# EasyEDA Pro project 主板以及2.4GHz接收器.eprj, board PCB7
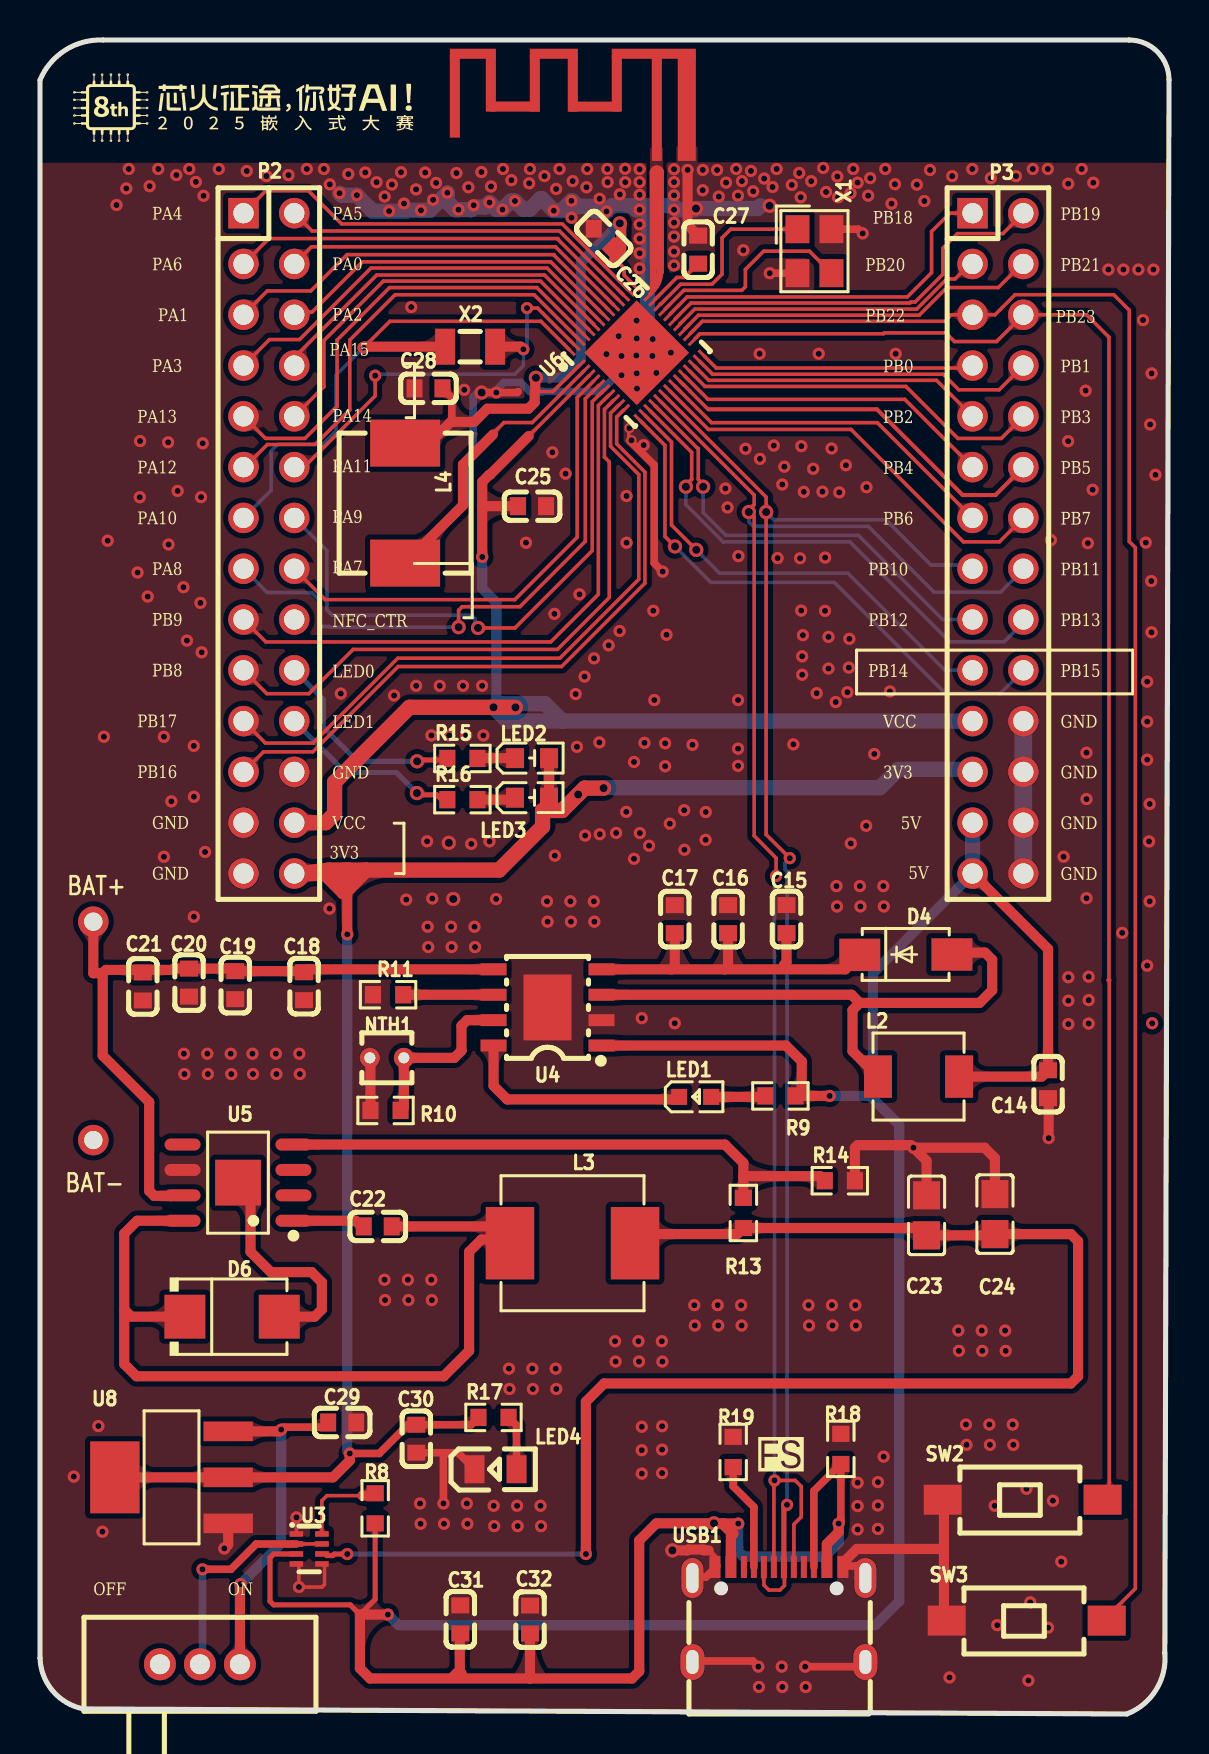
[diagram p12: board, top side]
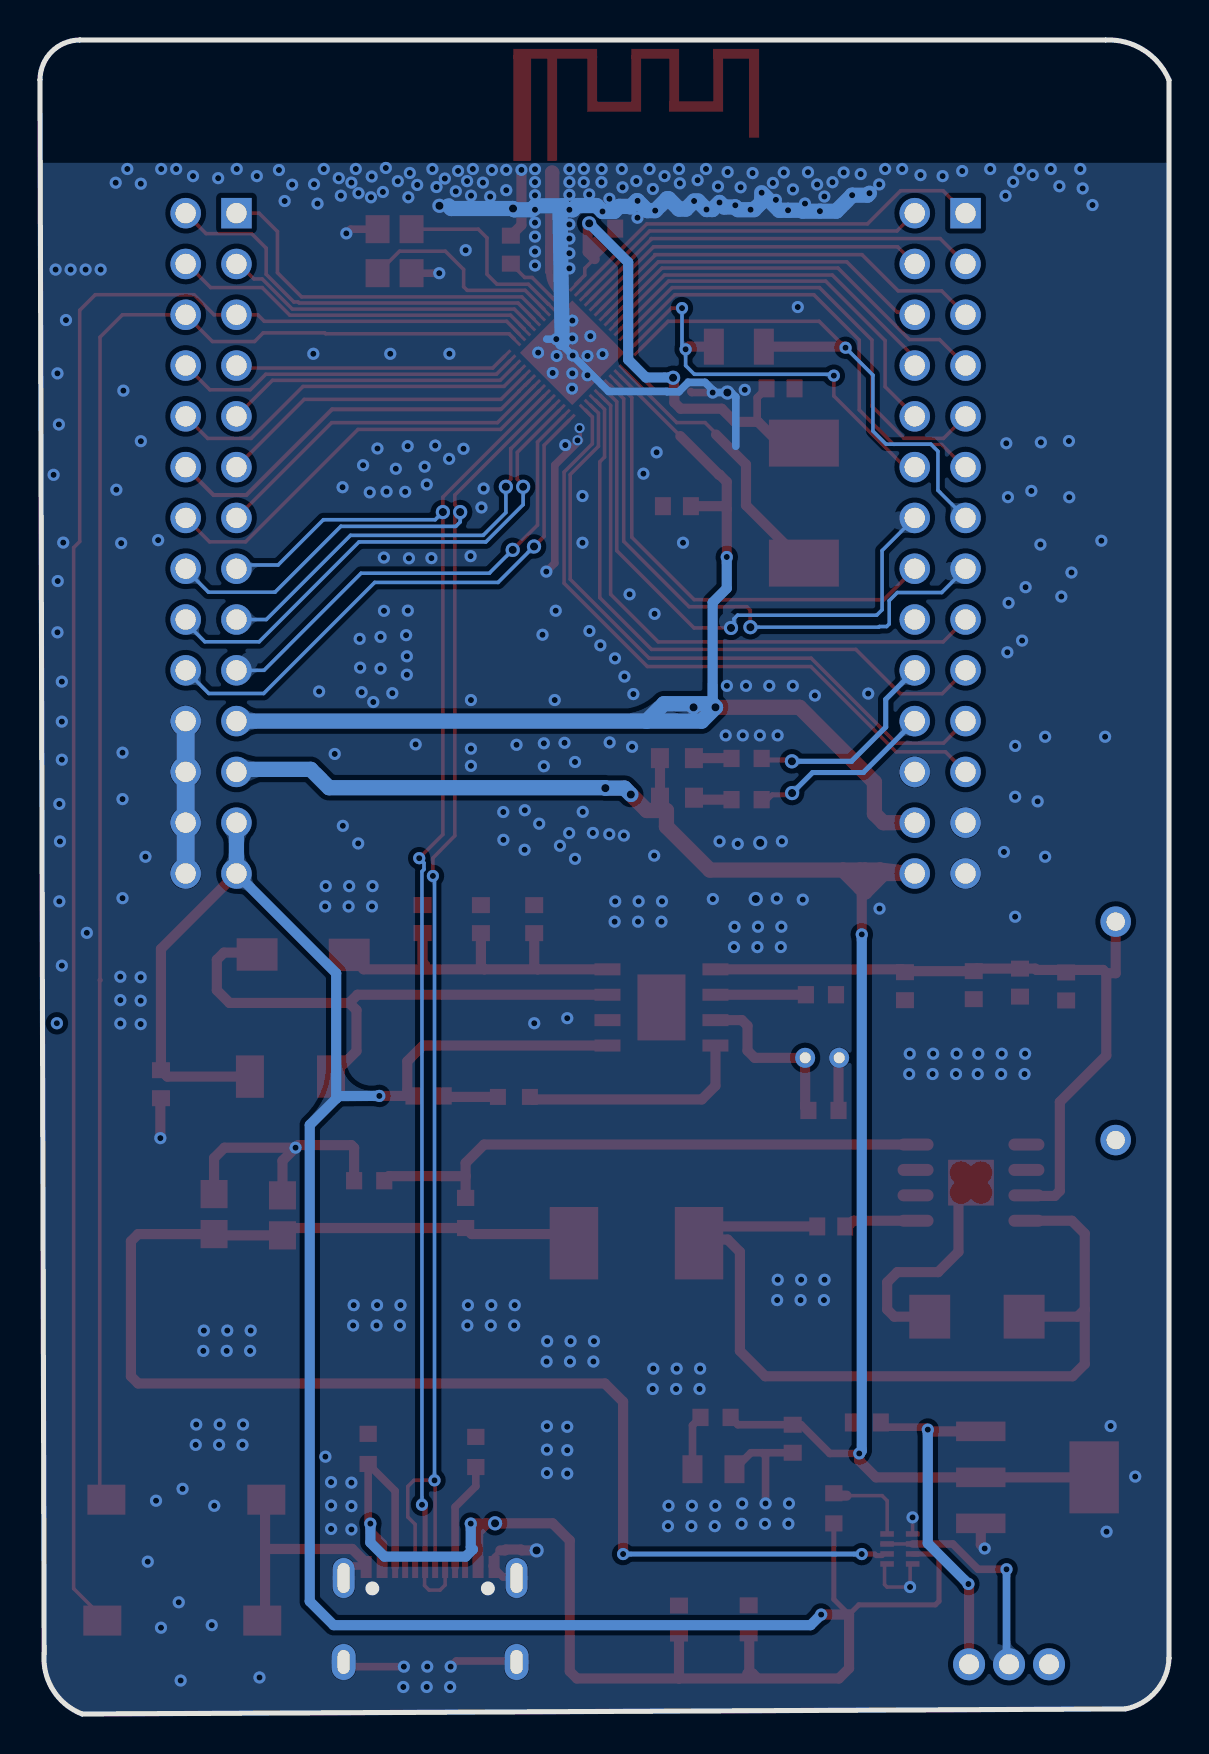
[diagram p13: board, bottom side, seen from below]

Outline 56.47 x 83.71 mm; copper layers: Top Layer, Bottom Layer. Coordinates in mm from the lower left corner of the outline.
Outline path: 0,81.71 arc(1.27,83.21) 3.16,83.71 54.47,83.71 arc(55.88,83.13) 56.47,81.71 56.26,3.05 arc(55.82,1.21) 54.36,0 2.18,0.25 arc(0.65,1.14) 0,2.79 0,81.71
Stack: Top Layer 0.035mm / Dielectric1 1.51mm FR4 er 4.5 / Bottom Layer 0.035mm

## Design rules (mm)
template: 自定义配置
spacing Clearance (default): track to track 0.127, other pairs 0 to 0.152
spacing Clearance_1: track to track 0.152, other pairs 0.152 to 0.152
spacing Clearance_3: track to track 0.254, other pairs 0 to 0.254
track width Width (default): min 0.127, default 0.178, max 1.27
differential pair DiffPairsRouting (default): width min 0.178, default 0.381, max 0.381; gap min 0.152, default 0.254
via RoutingVias (default): diameter min 0.508, default 0.61, max 1.27; hole min 0.305, default 0.305, max 0.711
region e2530 uses Clearance_1, DiffPairsRouting, HoleToHoleClearance, PlaneConnect, RF, RoutingVias, Width

## Placement (name value [footprint] x y rotation side)
C14  100nF  [C0603#2]  50.42 31.49 90 top
C15  10uF  [C0603#2]  37.34 39.75 270 top
C16  10uF  [C0603#2]  34.42 39.75 270 top
C17  10uF  [C0603#2]  31.75 39.75 270 top
C18  10uF  [C0603#2]  13.21 36.39 90 top
C19  10uF  [C0603#2]  9.77 36.45 90 top
C20  10uF  [C0603#2]  7.45 36.57 90 top
C21  10uF  [C0603#2]  5.14 36.38 90 top
C22  100nF  [C0603#2]  16.89 24.38 0 top
C23  22uF  [C0805]  44.34 24.94 90 top
C24  22uF  [C0805]  47.76 25 90 top
C25  2.2uF  [C0603#2]  24.61 60.4 180 top
C26  100nF  [C0603]  28.19 73.78 135 top
C27  470nF  [C0603#2]  32.92 73.23 270 top
C28  4.7uF  [C0603#2]  19.43 66.29 0 top
C29  10uF  [C0603#2]  15.11 14.58 180 top
C30  22uF  [C0603#2]  18.82 13.76 90 top
C31  22uF  [C0603#2]  21.02 4.73 270 top
C32  22uF  [C0603#2]  24.51 4.72 270 top
D4  SS54  [SMA_L4.3-W2.6-LS5.0-FD]  43.31 37.97 180 top
D6  SS54SMB  [SMB_L4.6-W3.6-LS5.3-RD]  9.61 19.87 0 top
E1  F  [ANT-F-1-2.4G-1.6mmFR4]  30.86 77.98 0 top
L2  2.2uH  [IND-SMD_L4.4-W4.2]  43.94 31.88 0 top
L3  15uH  [IND-SMD_L7.0-W6.6_FXL0630]  26.64 23.54 180 top
L4  10uH  [IND-SMD_L7.3-W6.8]  18.26 60.55 90 top
LED1  LTST-C190KSKT  [LED0603-RD]  32.77 30.86 0 top
LED2  YLED0603B  [LED0603-FD]  24.61 45.82 180 top
LED3  YLED0603R  [LED0603-FD]  24.61 47.8 180 top
LED4  NCD0805R1  [LED0805-R-RD]  22.78 12.24 0 top
NOREF  -  [Pad_e1653]  2.67 28.7 0 top
NOREF#2  -  [Pad_e1652]  2.67 39.62 0 top
NTH1  100K  [RES-TH_L2.5-W2.5-P1.70-D0.3]  17.35 32.81 180 top
P2  HEADER 14x2  [IDC28-2.54MM]  10.18 75.05 0 top
P3  HEADER 14x2  [IDC28-2.54MM]  46.64 75.05 0 top
R8  10kΩ  [R0603]  16.76 10.28 270 top
R9  1kΩ  [R0603]  37.03 30.91 180 top
R10  82kΩ  [R0603]  17.28 30.18 180 top
R11  1kΩ  [R0603]  17.41 35.97 180 top
R13  10kΩ  [R0603]  35.18 25.05 90 top
R14  3.16kΩ  [R0603]  40.01 26.67 0 top
R15  1kΩ  [R0603]  21.13 47.78 0 top
R16  1kΩ  [R0603]  21.13 45.72 0 top
R17  1kΩ  [R0603]  22.68 14.83 0 top
R18  5.1kΩ  [R0603]  40.06 13.26 270 top
R19  5.1kΩ  [R0603]  34.67 13.1 270 top
SW1  SSSS916900  [SW-TH_SSSS916900]  8 2.49 90 top
SW2  TS-1101-C-W  [SW-SMD_L6.0-W3.3-LS8.0]  49.15 10.72 0 top
SW3  TS-1101-C-W  [SW-SMD_L6.0-W3.3-LS8.0]  49.35 4.67 0 top
U3  LM66200DRLR  [SOT-583-8_L2.1-W1.2-P0.50-LS1.6-BL]  13.46 8.25 270 top
U4  SCS5090EA  [ESOP-8_L4.9-W3.9-P1.27-LS6.0-BL-EP3.3]  25.39 35.33 90 top
U5  TPS5450DDAR  [SOP-8_L4.9-W3.9-P1.27-LS6.0-BL-EP]  9.9 26.57 90 top
U6  CH585M  [QFN-48_L5.0-W5.0-P0.35-TL-EP3.7-1]  29.85 68.07 45 top
U8  AMS1117-3.3  [SOT-223-4_L6.5-W3.5-P2.30-LS7.0-BR]  6.58 11.83 0 top
USB1  TYPE-C 16PIN 2MD(073)  [USB-C-SMD_TYPE-C-6PIN-2MD-073]  36.96 4.98 0 top
X1  32MHz  [CRYSTAL-SMD_4P-L3.2-W2.5-BL]  38.73 73.15 270 top
X2  32.768kHz  [FC-135R_L3.2-W1.5]  21.51 68.37 0 top

## Footprints (pads in the part's own frame, mm; a bottom-side part is the same pattern mirrored in y, then rotated)
ANT-F-1-2.4G-1.6mmFR4
  rect 0.8x0.6 smd: 0(1.483,0)
  rect 0.4x0.6 smd: 1(0,0)
C0603
  rect 0.8x0.9 smd: 1(-0.7,0)
  rect 0.8x0.9 smd rot 45: 2(0.7,0)
C0603#2
  rect 0.8x0.9 smd: 1(-0.7,0) 2(0.7,0)
C0805
  rect 1.41x1.35 smd: 1(-1,0) 2(1,0)
CRYSTAL-SMD_4P-L3.2-W2.5-BL
  rect 1.4x1.2 smd: 1(-1.1,-0.85) 2(1.1,-0.85) 3(1.1,0.85) 4(-1.1,0.85)
ESOP-8_L4.9-W3.9-P1.27-LS6.0-BL-EP3.3
  rect 0.6x1.3 smd: 1(-1.905,-2.7) 2(-0.635,-2.7) 3(0.635,-2.7) 4(1.905,-2.7) 5(1.905,2.7) 6(0.635,2.7) 7(-0.635,2.7) 8(-1.905,2.7)
  rect 3.3x2.4 smd: 9(0,0)
FC-135R_L3.2-W1.5
  rect 1x1.8 smd: 1(-1.25,0) 2(1.25,0)
IDC28-2.54MM
  rect 1.524x1.524 hole 1.016: 1(0,0)
  round 1.524 hole 1.016: 2(2.54,0) 3(0,-2.54) 4(2.54,-2.54) 5(0,-5.08) 6(2.54,-5.08) 7(0,-7.62) 8(2.54,-7.62) 9(0,-10.16) 10(2.54,-10.16) 11(0,-12.7) 12(2.54,-12.7) 13(0,-15.24) 14(2.54,-15.24) 15(0,-17.78) 16(2.54,-17.78) 17(0,-20.32) 18(2.54,-20.32) 19(0,-22.86) 20(2.54,-22.86) 21(0,-25.4) 22(2.54,-25.4) 23(0,-27.94) 24(2.54,-27.94) 25(0,-30.48) 26(2.54,-30.48) 27(0,-33.02) 28(2.54,-33.02)
IND-SMD_L4.4-W4.2
  rect 1.4x2.12 smd: 1(2.028,0) 2(-2.028,0)
IND-SMD_L7.0-W6.6_FXL0630
  rect 2.424x3.62 smd: 1(3.128,0) 2(-3.128,0)
IND-SMD_L7.3-W6.8
  rect 2.35x3.5 smd: 1(-3,0) 2(3,0)
LED0603-FD
  rect 0.9x1 smd: 1(-0.85,0) 2(0.85,0)
LED0603-RD
  rect 0.8x0.8 smd: 1(-0.799,0) 2(0.799,0)
LED0805-R-RD
  rect 1x1.399 smd: 1(1.05,0) 2(-1.05,0)
Pad_e1652
  round 1.524 hole 0.914: 1(0,0)
Pad_e1653
  round 1.524 hole 0.914: 1(0,0)
QFN-48_L5.0-W5.0-P0.35-TL-EP3.7-1
  rect 0.8x0.15 smd: 1(-2.5,1.575) 2(-2.5,1.225) 3(-2.5,0.875) 4(-2.5,0.525) 5(-2.5,0.175) 6(-2.5,-0.175) 7(-2.5,-0.525) 8(-2.5,-0.875) 9(-2.5,-1.225) 10(-2.5,-1.575) 25(2.5,-1.575) 26(2.5,-1.225) 27(2.5,-0.875) 28(2.5,-0.525) 29(2.5,-0.175) 30(2.5,0.175) 31(2.5,0.525) 32(2.5,0.875) 33(2.5,1.225) 34(2.5,1.575)
  rect 0.15x0.8 smd: 11(-2.275,-2.5) 12(-1.925,-2.5) 13(-1.575,-2.5) 14(-1.225,-2.5) 15(-0.875,-2.5) 16(-0.525,-2.5) 17(-0.175,-2.5) 18(0.175,-2.5) 19(0.525,-2.5) 20(0.875,-2.5) 21(1.225,-2.5) 22(1.575,-2.5) 23(1.925,-2.5) 24(2.275,-2.5) 35(2.275,2.5) 36(1.925,2.5) 37(1.575,2.5) 38(1.225,2.5) 39(0.875,2.5) 40(0.525,2.5) 41(0.175,2.5) 42(-0.175,2.5) 43(-0.525,2.5) 44(-0.875,2.5) 45(-1.225,2.5) 46(-1.575,2.5) 47(-1.925,2.5) 48(-2.275,2.5)
  rect 3.7x3.7 smd: 49(0.001,0)
R0603
  rect 0.806x0.864 smd: 1(-0.753,0) 2(0.753,0)
RES-TH_L2.5-W2.5-P1.70-D0.3
  round 1 hole 0.55: 1(-0.85,0) 2(0.85,0)
SMA_L4.3-W2.6-LS5.0-FD
  rect 2.046x1.62 smd: 1(-2.304,-0.009) 2(2.304,0.009)
SMB_L4.6-W3.6-LS5.3-RD
  rect 2.047x2.192 smd: 1(-2.361,0) 2(2.361,0)
SOP-8_L4.9-W3.9-P1.27-LS6.0-BL-EP
  oval 0.6x1.8 smd: 1(-1.905,-2.772) 2(-0.635,-2.772) 3(0.635,-2.772) 4(1.905,-2.772) 5(1.905,2.772) 6(0.635,2.772) 7(-0.635,2.772) 8(-1.905,2.772)
  rect 2.29x2.29 smd: 9(0,0)
SOT-223-4_L6.5-W3.5-P2.30-LS7.0-BR
  rect 2.47x0.98 smd: 1(2.835,-2.3) 2(2.835,0) 3(2.835,2.3)
  rect 2.47x3.6 smd: 4(-2.835,0)
SOT-583-8_L2.1-W1.2-P0.50-LS1.6-BL
  rect 0.28x0.68 smd: 1(-0.75,-0.64) 2(-0.25,-0.64) 3(0.25,-0.64) 4(0.75,-0.64) 5(0.75,0.64) 6(0.25,0.64) 7(-0.25,0.64) 8(-0.75,0.64)
SW-SMD_L6.0-W3.3-LS8.0
  rect 1.9x1.5 smd: 1(-4,0) 2(4,0)
SW-TH_SSSS916900
  round 1.6 hole 1: 1(0,2) 2(0,0) 3(0,-2)
USB-C-SMD_TYPE-C-6PIN-2MD-073
  rect 0.55x1.1 smd: 1(-3.2,2.375) 2(-2.4,2.375) 11(2.4,2.375) 12(3.2,2.375)
  rect 0.3x1.1 smd: 3(-1.75,2.375) 4(-1.25,2.375) 5(-0.75,2.375) 6(-0.25,2.375) 7(0.25,2.375) 8(0.75,2.375) 9(1.25,2.375) 10(1.75,2.375)
  oval 1.1x2 hole 0.6x1.5: 13(-4.325,1.825) 14(4.325,1.825)
  oval 1.2x1.8 hole 0.6x1.2: 13(-4.325,-2.375) 14(4.325,-2.375)

## Nets
As in the schematic, except:
BAT+: C18.2 C19.2 C20.2 C21.2 NOREF#2.1 U4.5 U5.7

Pads without a net: E1 0; NOREF 1; P2 17 18 19 21 23; SW1 1; U5 2 3 5; U6 7 8 9 10; USB1 3 9

## Via types
v1: diameter 0.61, hole 0.305, Top Layer to Bottom Layer, 433 vias
v2: diameter 0.711, hole 0.406, Top Layer to Bottom Layer, 23 vias
v3: diameter 0.508, hole 0.305, Top Layer to Bottom Layer, 2 vias

## Routing (per net, layer and track width the routed paths; a pad name or vN(x,y) marks a point on that pad's centre or on a via; arc(x,y) is an arc through that point)
+3V3: length 94.1
  Top Layer w0.381: v1(15.49,13.03) 16.97,13.03 18.4,14.46 C30.2 21.56,14.46 R17.1
  Top Layer w0.508: LED2.1 25.46,47.8 LED3.1 ; U8.4 U8.2 14.66,11.83 15.49,12.67 v1(15.49,13.03) ; 15.21,41.11 15.37,40.95 v1(15.37,38.99)
  Top Layer w0.762: 16.3,42.2 22.96,42.2 25.14,44.38 25.14,45.18 26.12,45.18 v2(26.92,45.98) 27.24,46.3 v2(28.19,46.3) ; 16.3,42.2 15.46,42.2 ; 16.3,42.2 15.44,41.34 ; 13.01,42.03 14.29,42.03 ; 13.01,42.03 P2.28 ; 13.01,42.03 14.46,42.2 ; 14.29,42.03 14.46,42.2 ; 14.29,42.03 15.21,41.11 ; 15.44,41.34 15.46,42.2 ; 15.44,41.34 15.21,41.11 ; 15.46,42.2 15.21,42.2 ; 14.46,42.2 15.21,42.2 ; 15.21,42.2 15.21,41.11
  Bottom Layer w0.508: v1(15.37,38.99) 15.37,13.16 v1(15.49,13.03)
  Bottom Layer w0.762: P3.23 46.52,47.24 42.93,47.24 42.01,46.32 28.21,46.32 v2(28.19,46.3) 27.24,46.3 v2(26.92,45.98)
+5V: length 169.2
  Top Layer w0.254: U3.3 11.68,8 11.5,7.82 11.5,5.64 11.68,5.46 15.52,5.46 16,4.97 16.76,5.73 R8.2
  Top Layer w0.381: v1(39.95,9.52) 40.06,9.63 R18.2 38.71,11.15 38.71,7.35
  Top Layer w0.508: U4.1 37.31,33.43 38.1,32.64 38.1,31.22 R9.1 v1(39.5,30.91) ; v1(34.92,9.52) 33.72,9.52 v2(33.71,9.54) 30.83,9.54 29.97,8.68 29.97,2.13 29.61,1.78 24.51,1.78 ; 24.51,1.78 24.51,1.78 24.51,3.81 ; 24.51,1.78 16.51,1.78 16,2.28 16,4.97 v1(17.4,4.97) ; P3.27 50.42,38.26 C14.2 50.1,31.88 L2.1 ; 20.6,1.8 20.83,2.03 21.08,2.03 21,2.12 21,3.68 ; 34.66,9.01 34.56,8.9 USB1.2 ; USB1.11 39.36,8.51 39.95,9.09 v1(39.95,9.52)
  Top Layer w0.559: 34.66,9.01 34.15,9.52
  Bottom Layer w0.508: P3.27 41.66,37.04 41.66,30.77 ; 41.66,30.77 42.98,29.45 42.98,5.64 41.78,4.44 17.93,4.44 v1(17.4,4.97) ; 41.66,30.77 41.52,30.91 v1(39.5,30.91) ; v1(34.92,9.52) 34.92,8.34 34.82,8.23 35.18,7.87 39.24,7.87 39.95,8.57 v1(39.95,9.52)
  Bottom Layer w0.762: P3.27 P3.25
GND: length 120.8
  Top Layer w0.178: 13.08,6.35 14.1,6.35 14.23,6.47 14.23,7.5 ; v1(12.95,6.35) 12.95,6.35 12.95,7.5 ; 29.46,64.3 29.45,64.29 29.45,63.72 ; v1(12.83,9.83) 12.83,9.01 U3.1
  Top Layer w0.254: USB1.1 33.76,7.87 33.45,8.18
  Top Layer w0.381: LED4.2 20.91,13.06 20.35,13.06 ; 23.92,66.13 23.87,66.08 v1(22.82,66.08) v2(22.09,66.08) ; X1.4 40.94,74.25 v1(41.15,74.04) ; v1(35.93,2.37) 35.65,2.65 32.73,2.65 ; C30.1 20.35,13.06 ; 20.35,13.06 20.18,12.9 v1(20.18,10.53) ; X1.2 v1(36.5,72.05) ; 20.65,40.78 v2(20.67,40.76) ; v1(31.14,57.13) 30.72,57.55 30.72,62.45 29.48,63.69 ; USB1.14 41.05,2.37 v1(38.27,2.37) ; 33.86,7.4 33.31,6.85 32.73,6.85 ; 40.26,7.4 40.83,7.4 41.38,6.85
  Top Layer w0.508: v1(50.45,28.8) 50.45,30.76 C14.1 ; R10.2 16.53,32.78 NTH1.2 ; v1(43.69,28.32) 44.34,27.66 C23.2 ; v1(43.69,28.32) 47.24,28.32 47.76,27.8 C24.2 ; v1(43.69,28.32) 43.56,28.45 40.89,28.45 40.76,28.31 R14.2 ; 40.34,7.74 40.85,8.25 44.96,8.25 ; C27.1 32.39,74.45 v1(32.39,77.21) ; 45.21,10.67 45.21,4.7 ; 33.45,8.18 33.21,8.18 33.17,8.22 32.42,8.22 32.38,8.18 v2(31.63,8.18) ; U8.1 9.41,8.47 v1(9.22,8.28)
  Bottom Layer w0.381: 31.12,68.75 v1(30.65,68.75) v1(29.83,67.93) 28.03,66.14 25.11,66.14 25.09,66.12 24.51,66.12 24.05,66.59 23.21,66.59 22.82,66.21 v1(22.82,66.08) v2(22.09,66.08) 21.89,66.08 21.67,65.86 21.67,63.4
  Bottom Layer w0.762: 30.35,68.58 30.46,75.29 30.33,75.42 ; 30.33,75.42 30.14,75.22 29.81,75.22 29.6,75.43 28.63,75.43 v1(28.33,75.14) 27.75,75.14 27.5,75.39 26.96,75.39 ; 30.33,75.42 31.68,75.42 31.88,75.22 32.75,75.22 v2(32.81,75.28) 35.9,75.28 36.04,75.42 ; v1(20.37,76.07) 19.5,75.2 v1(19.05,75.2) 18.37,75.2 18.33,75.15 v1(17.46,75.15) 16.64,75.15 15.85,75.94 v1(15.85,75.95) 15.08,75.95 v1(14.98,76.05) ; 20.37,75.85 20.37,75.6 20.75,75.23 v1(20.93,75.23) 21.56,75.23 21.69,75.36 22.26,75.36 v1(22.48,75.59) 22.84,75.23 v1(23.13,75.23) 23.56,75.66 v1(23.76,75.66) 24.16,75.25 24.51,75.25 25.03,75.77 25.11,75.77 v1(25.7,75.18) 26.09,75.18 v1(26.58,75.67) 26.63,75.67 26.94,75.36
  Bottom Layer w0.889: P3.28 P3.26 P3.24 P3.22
  vias: v1(1.69,11.87) v1(2.92,14.4) v1(3.12,9.12) v1(3.2,48.87) v1(3.38,58.67) v1(3.83,75.46) v1(4.32,76.29) v1(4.44,77.26) v1(4.88,57.08) v1(5.01,63.66) v1(4.99,60.85) v1(5.39,55.88) v1(5.48,76.4) v1(5.92,77.26) v1(6.2,48.87) v1(6.2,42.87) v1(6.41,63.59) v1(6.43,58.48) v1(6.57,45.64) v1(6.82,76.96) v1(6.89,61.16) v1(7.17,56.35) v1(7.2,33.02) v1(7.23,32) v1(7.35,53.68) v1(7.47,77.26) v1(7.69,48.41) v1(7.7,45.87) v1(7.7,39.87) v1(7.8,76.61) v1(8.06,60.85) v1(8.03,55.56) v1(8.14,63.54) v1(8.09,53.09) v1(8.18,75.92) v1(8.26,43.11) v1(8.37,33.02) v1(8.4,32) v1(8.94,77.26) v1(9.54,33.02) v1(9.57,32) v1(10.34,77.16) v1(10.63,33.02) v1(10.65,32) v1(11.32,76.9) v1(11.8,33.02) v1(11.83,32) v1(12.43,76.96) v1(12.97,33.02) v1(13,32) v1(13.35,77.26) v1(14.2,77.26) v1(14.49,76.49) v1(14.48,40.27) v1(15.05,51.03) v1(15.42,77.01) v1(16.27,77.08) v1(16.83,76.6) v1(17.24,75.88) v1(17.23,21.72) v1(17.26,20.7) v1(17.6,76.48) v1(17.71,50.93) v1(18.06,77.1) v1(18.21,75.53) v1(18.32,40.72) v1(18.4,21.72) v1(18.43,20.7) v1(18.57,70.36) v1(18.81,76.24) v1(18.82,51.41) v1(19.01,10.53) v1(19.04,9.51) v1(19.27,77.08) v1(19.36,43.64) v1(19.39,39.37) v1(19.42,38.35) v1(19.57,21.71) v1(19.66,75.72) v1(19.58,48.94) v1(19.62,40.78) v1(19.6,20.7) v1(19.81,76.56) v1(19.99,51.41) v1(20.21,9.51) v1(20.46,48.94) v1(20.56,39.37) v1(20.59,38.35) v1(20.83,77.06) v1(21.16,51.41) v1(21.22,66.22) v1(21.32,48.94) v1(21.35,10.53) v1(21.43,76.35) v1(21.38,9.51) v1(21.57,43.51) v1(21.69,75.45) v1(21.73,39.37) v1(21.76,38.35) v1(22.08,77.11) v1(22.11,51.41) v1(22.17,48.94) v1(22.56,76.39) v1(22.48,43.64) v1(22.69,10.41) v1(22.72,9.4) v1(22.81,40.75) v1(23.16,77.26) v1(23.45,17.27) v1(23.48,16.25) v1(23.58,76.7) v1(23.86,10.41) v1(23.89,9.4) v1(24.31,58.57) v1(24.47,76.54) v1(24.51,77.26) v1(24.62,17.27) v1(24.65,16.25) v1(25.03,10.41) v1(25.06,9.39) v1(25.23,76.9) v1(25.36,40.64) v1(25.39,39.62) v1(25.63,63.09) v1(25.73,55.01) v1(25.75,42.92) v1(25.81,76.26) v1(25.8,17.27) v1(25.82,16.25) v1(25.98,77.26) v1(26.29,62.02) v1(26.53,40.64) v1(26.56,39.62) v1(26.64,76.65) v1(26.59,74.82) v1(26.79,51) v1(26.86,48.36) v1(26.98,55.99) v1(27.24,51.88) v1(27.27,43.93) v1(27.37,77.26) v1(27.33,76.35) v1(27.71,52.79) v1(27.7,40.64) v1(27.73,39.62) v1(27.99,75.77) v1(27.98,48.58) v1(28,43.99) v1(28.33,68) v1(28.38,77.26) v1(28.39,76.6) v1(28.44,53.44) v1(28.76,18.64) v1(28.82,44.06) v1(28.79,17.63) v1(28.94,68.9) v1(29,75.99) v1(28.99,54.16) v1(29.09,67.91) v1(29.09,66.94) v1(29.27,77.27) v1(29.27,76.6) v1(29.34,60.91) v1(29.34,58.57) v1(29.32,45.11) v1(29.71,47.61) v1(29.71,42.76) v1(29.84,69.68) v1(29.85,68.79) v1(29.85,67.04) v1(29.86,66.28) v1(29.93,18.64) v1(29.96,17.63) v1(29.99,77.25) v1(29.99,76.6) v1(29.99,75.97) v1(29.99,75.22) v1(29.99,74.49) v1(29.99,73.78) v1(29.99,73.05) v1(29.99,72.29) v1(30,44.05) v1(30.1,34.8) v1(30.1,14.36) v1(30.1,13.19) v1(30.1,12.02) v1(30.2,63.45) v1(30.23,48.56) v1(30.46,43.42) v1(30.63,67.91) v1(30.68,55.17) v1(30.73,50.7) v1(30.83,67.06) v1(31.1,18.64) v1(31.13,17.62) v1(31.12,14.39) v1(31.11,13.22) v1(31.11,12.05) v1(31.27,48.54) v1(31.27,47.39) v1(31.34,53.97) v1(31.55,68.08) v1(31.5,44.52) v1(31.71,77.25) v1(31.71,76.6) v1(31.71,75.94) v1(31.71,75.22) v1(31.71,74.58) v1(31.71,73.88) v1(31.71,73.13) v1(31.71,72.44) v1(31.75,34.54) v1(32.22,45.19) v1(32.23,43.22) v1(32.64,48.47) v1(32.73,20.45) v1(32.75,19.43) v1(33.15,77.21) v1(33.15,76.2) v1(33.3,45.1) v1(33.29,43.71) v1(33.87,77.21) v1(33.95,75.88) v1(33.9,20.45) v1(33.92,19.43) v1(34.32,76.58) v1(34.28,61.28) v1(34.39,60.33) v1(34.82,77.26) v1(34.91,75.93) v1(34.93,57.9) v1(34.92,50.7) v1(34.92,48.27) v1(34.92,47.41) v1(35.07,20.44) v1(35.11,76.65) v1(35.09,19.43) v1(35.18,73.2) v1(35.29,63.27) v1(35.56,77.16) v1(35.67,76.14) v1(35.96,1.35) v1(35.99,68.02) v1(36.01,62.76) v1(36.22,76.78) v1(36.64,76.36) v1(36.7,63.43) v1(36.84,77.26) v1(36.89,57.8) v1(37.13,61.48) v1(37.1,2.37) v1(37.13,1.35) v1(37.23,62.37) v1(37.6,76.46) v1(37.68,48.49) v1(37.97,77.06) v1(38.05,75.85) v1(38.02,57.79) v1(38.08,63.4) v1(38.07,55.18) v1(38.16,53.95) v1(38.12,52.89) v1(38.12,51.97) v1(38.2,61.12) v1(38.3,1.35) v1(38.44,20.45) v1(38.47,19.43) v1(38.57,76.65) v1(38.67,62.27) v1(38.85,51.05) v1(38.95,68.02) v1(39.14,61.13) v1(39.17,77.31) v1(39.27,57.83) v1(39.26,55.17) v1(39.32,76.11) v1(39.44,53.86) v1(39.44,52.28) v1(39.59,63.28) v1(39.61,20.45) v1(39.64,19.43) v1(39.8,50.6) v1(39.84,41.4) v1(39.86,40.38) v1(39.88,76.88) v1(39.92,75.85) v1(39.98,61.09) v1(40.31,62.45) v1(40.46,52.33) v1(40.38,51.1) v1(40.54,76.05) v1(40.48,53.76) v1(40.55,43.53) v1(40.67,77.26) v1(40.78,20.44) v1(40.81,19.43) v1(40.89,76.58) v1(40.89,11.57) v1(40.89,10.4) v1(40.89,9.23) v1(41.01,41.4) v1(41.04,40.38) v1(41.34,61.35) v1(41.32,44.41) v1(41.42,75.93) v1(41.53,76.8) v1(41.73,48.01) v1(41.91,11.6) v1(41.91,10.43) v1(41.91,9.25) v1(42.18,41.4) v1(42.21,40.38) v1(42.2,12.87) v1(42.28,77.26) v1(42.51,51.13) v1(42.59,75.53) v1(42.76,76.5) v1(42.8,68.02) v1(43.86,76.48) v1(44.23,75.66) v1(44.52,77.21) v1(45.49,1.83) v1(45.62,76.9) v1(45.93,19.18) v1(45.96,18.16) v1(46.31,14.48) v1(46.34,13.46) v1(46.63,77.26) v1(47.1,19.18) v1(47.13,18.16) v1(47.56,76.8) v1(47.48,14.48) v1(47.51,13.46) v1(47.75,10.41) v1(47.88,4.44) v1(48.27,19.17) v1(48.3,18.16) v1(48.65,14.48) v1(48.68,13.46) v1(48.82,76.9) v1(49.34,11.26) v1(49.44,1.67) v1(49.53,5.59) v1(49.66,77.26) v1(50.41,77.26) v1(50.42,4.32) v1(50.56,58.7) v1(50.67,10.67) v1(51.08,7.62) v1(51.2,42.87) v1(51.43,76.52) v1(51.42,63.65) v1(51.44,36.84) v1(51.43,35.67) v1(51.43,34.5) v1(52.1,77.26) v1(52.3,66.18) v1(52.34,48.07) v1(52.34,45.75) v1(52.34,40.8) v1(52.41,58.55) v1(52.45,36.87) v1(52.45,35.7) v1(52.45,34.53) v1(52.65,61.22) v1(52.68,76.57) v1(53.44,72.23) v1(54.13,39.06) v1(54.19,72.23) v1(54.94,72.23) v1(55.17,69.7) v1(55.31,58.58) v1(55.38,51.62) v1(55.38,49.63) v1(55.38,47.72) v1(55.47,43.63) v1(55.38,37.42) v1(55.53,64.48) v1(55.5,45.51) v1(55.5,40.64) v1(55.6,67.04) v1(55.58,56.65) v1(55.6,54.09) v1(55.69,72.23) v1(55.79,61.97) v2(20.45,43.56) v2(36.49,75.42) v3(29.48,64.3) v3(29.58,63.69)
V5V: length 17.8
  Top Layer w0.381: 14.51,14.34 12.19,14.34 v1(12.07,14.22)
  Top Layer w0.508: v1(12.07,14.22) 11.98,14.13 U8.3 ; v1(10.03,6.5) 10,6.47 10,2.49
  Bottom Layer w0.508: v1(10.03,6.5) 12.07,8.53 v1(12.07,14.22)
VCC: length 63.3
  Top Layer w0.178: 27.46,66.92 24.44,63.9
  Top Layer w0.508: 22.12,60.24 22.28,60.4 C25.2 ; 22.12,60.24 22.12,61.61 22.48,61.97 22.51,61.97 24.44,63.9 ; 22.12,60.24 v1(22.12,57.86)
  Top Layer w0.762: P2.26 14.29,44.57 14.73,45.02 14.73,46.6 18.48,50.34 v2(22.68,50.34) 22.69,50.34 v2(23.78,50.34)
  Bottom Layer w0.508: 22.86,50.52 22.83,50.56 22.83,55.58 22.12,56.29 v1(22.12,57.86)
  Bottom Layer w0.762: 26.13,49.65 25.26,50.52 22.86,50.52 v2(22.68,50.34) 23.37,49.65 26.13,49.65 ; 26.13,49.65 P3.21
VINTA: length 2.5
  Top Layer w0.178: 32.64,72.23 32.62,72.23 32.23,71.84 31.86,71.84 30.77,70.75
(no net): length 126.8
  Top Layer w0.178: P2.17 11.3,53.61 25.55,53.61 27.93,55.99 27.93,65.43 28.44,65.95 ; P2.21 11.28,48.55 13.65,48.55 17.9,52.8 26,52.8 29.95,56.75 29.95,61.98 28.54,63.39 28.54,65.05 28.94,65.45 ; P2.19 11.35,51.02 13.45,51.02 15.66,53.24 25.88,53.24 28.47,55.82 28.47,62.62 28.23,62.85 28.23,65.24 28.69,65.7 ; P2.23 11.18,48.11 13.65,48.11 17.91,52.38 26.09,52.38 30.26,56.54 30.26,62.1 28.84,63.52 28.84,64.86 29.18,65.2
  vias: v1(55.63,34.54)
ANT: length 13.6
  Top Layer w0.178: 30.52,70.99 30.71,71.19 arc(30.98,71.58) 31.07,72.05 31.12,72.1 31.12,73.37 ; 30.52,70.99 arc(30.53,71) 30.54,71.01 ; 30.52,70.99 arc(30.78,71.36) 30.91,71.79 ; 30.52,70.99 arc(30.73,71.31) 30.8,71.68 30.91,71.79 ; 30.52,70.99 arc(30.65,71.19) 30.7,71.43 30.76,71.48 30.76,72.53 ; 30.52,70.99 arc(30.53,71) 30.54,71.01 ; 30.52,70.99 arc(30.53,71) 30.54,71.01 ; 30.52,70.99 arc(30.53,71.01) 30.54,71.03 30.6,71.1 30.6,72.57 ; 30.91,71.79 30.93,71.81 30.93,71.98 ; 30.91,71.79 arc(30.92,71.87) 30.92,71.96 30.93,71.98 ; 30.93,71.98 30.98,72.03 30.98,72.34 30.93,72.39 ; 30.93,71.98 30.93,72.39 ; 30.93,72.39 30.8,72.52
  Top Layer w0.714: 30.86,77.09 30.85,77.08 30.85,72.57
BAT+: length 36.5
  Top Layer w0.508: 3.14,37.04 3.3,37.21 6.63,37.21 6.69,37.27 C20.2 9.64,37.27 C19.2 13.15,37.15 C18.2 13.35,37.24 U4.5 ; 3.14,37.04 2.67,37.04 NOREF#2.1 ; 3.14,37.04 3.14,32.93 5.46,30.6 5.46,26.16 5.72,25.91 7.1,25.91 U5.7
BATO: length 75.3
  Top Layer w0.254: 14.34,7.92 14.64,7.92 14.72,8 v1(15.37,8)
  Top Layer w0.508: L3.2 30.22,24 34.88,24 R13.1 43.98,24.3 C23.1 47.7,23.94 C24.1 51.56,24 51.92,23.64 51.92,16.89 51.56,16.53 28.22,16.53 27.3,15.62 v1(27.3,8)
  Bottom Layer w0.254: v1(27.3,8) v1(15.37,8)
BOOT: length 89.4
  Top Layer w0.178: 32.5,69.01 33.13,69.64 45.25,69.64 45.58,69.97 P3.5 47.77,69.97 48.77,70.97 53.7,70.97 54.48,70.2 54.48,58.63 54.79,58.33 54.79,6.27 53.21,4.7
EP: length 44.2
  Top Layer w0.508: 23.33,23.72 22.67,24.38 C22.2 ; 23.33,23.72 L3.1 ; 23.33,23.72 22.08,23.72 21.46,23.11 21.46,18.16 20.19,16.89 4.83,16.89 4.21,17.5 4.21,20.23 ; 4.21,20.23 4.57,19.87 D6.1 ; 4.21,20.23 4.21,24.02 4.86,24.67 U5.8
FB: length 28.8
  Top Layer w0.508: U5.4 34.26,28.48 35.18,27.55 35.18,26.89 ; 35.18,26.89 R13.2 ; 35.18,26.89 39.02,26.89 R14.1
LED0: length 10.6
  Top Layer w0.254: v2(18.86,47.64) 18.93,47.71 20.54,47.71 20.55,47.72
  Bottom Layer w0.254: v2(18.86,47.64) 15.88,47.64 14.17,49.35 14.17,50.74 P2.20
LED1: length 9.7
  Top Layer w0.254: R16.1 20.37,45.44 19.84,45.97 18.94,45.97 v2(18.85,46.05)
  Bottom Layer w0.254: P2.22 15.29,47.08 17.83,47.08 v2(18.85,46.05)
LX: length 28.1
  Top Layer w0.508: L2.2 40.64,33.15 40.64,35.2 41,35.56 ; 41,35.56 40.59,35.97 U4.3 ; 41,35.56 46.99,35.56 47.62,36.19 47.62,37.72 47.27,38.08 45.71,38.08 D4.1
PA0: length 17.5
  Top Layer w0.178: P2.4 13.58,73.37 25.78,73.37 28.69,70.47
PA1: length 20.7
  Top Layer w0.178: 28.44,70.22 25.72,72.94 25.72,72.98 15.36,72.98 13.54,71.16 11.37,71.16 P2.5
PA2: length 17.7
  Top Layer w0.178: P2.6 12.85,70.1 13.6,70.1 16.12,72.62 25.54,72.62 28.19,69.97
PA3: length 20.9
  Top Layer w0.178: P2.7 11.48,68.73 12.98,68.73 16.56,72.31 25.36,72.31 27.94,69.72
PA4: length 21.8
  Top Layer w0.178: 29.43,71.21 26.12,74.52 15.08,74.52 13.42,76.17 11.3,76.17 P2.1
PA5: length 18.2
  Top Layer w0.178: P2.2 13.61,74.16 25.98,74.16 29.18,70.96
PA6: length 20.6
  Top Layer w0.178: 28.93,70.71 25.9,73.74 25.9,73.78 11.45,73.78 P2.3
PA7: length 24.2
  Top Layer w0.178: P2.16 14.26,55.73 23.75,55.73 26.87,58.85 26.87,65.83 27.7,66.66
PA8: length 29.3
  Top Layer w0.178: 27.95,66.44 27.28,65.77 27.28,58.64 24,55.37 21.12,55.37 20.94,55.19 v2(20.94,54.35)
  Bottom Layer w0.178: v2(20.94,54.35) 14.52,54.35 14.49,54.38 14.12,54.38 14,54.51 14,55.67 13.59,56.08 11.37,56.08 P2.15
PA9: length 29
  Top Layer w0.178: 28.2,66.19 27.62,65.62 27.62,58.18 23.76,54.31 v2(21.91,54.31)
  Bottom Layer w0.178: P2.14 14.35,58.18 14.35,55.22 14.62,54.95 21.58,54.95 21.76,54.77 21.76,54.46 v2(21.91,54.31)
PA10: length 27.8
  Top Layer w0.178: 16.23,68.37 17.5,69.64 25.05,69.64 U6.48
  Top Layer w0.508: X2.1 16.23,68.37 v1(16.18,68.32)
  Bottom Layer w0.178: P2.13 11.56,61.19 11.56,63.14 11.91,63.5 14.15,63.5 14.81,64.16 14.81,66.95 v1(16.18,68.32)
PA11: length 21.7
  Top Layer w0.178: U6.47 24.89,70.3 v1(24.36,70.3) ; v1(16.76,66.93) 16.76,65.91 13.2,62.35 P2.12
  Top Layer w0.508: X2.2 24.05,68.37 v1(24.18,68.24)
  Bottom Layer w0.178: v1(24.36,70.3) 24.36,68.43 v1(24.18,68.24) 24.18,67.43 23.74,66.99 16.83,66.99 v1(16.76,66.93)
PA12: length 23.3
  Top Layer w0.178: 10.24,62.35 11.37,63.48 13.76,63.48 15.49,65.21 15.49,68.7 17.76,70.97 24.71,70.97 26.95,68.73
PA13: length 23.5
  Top Layer w0.178: 27.2,68.98 24.85,71.33 17.48,71.33 14.86,68.7 14.86,65.4 13.25,63.79 11.28,63.79 P2.9
PA14: length 19.9
  Top Layer w0.178: P2.10 14.2,66.37 14.2,68.68 17.17,71.65 25.03,71.65 27.45,69.24 27.45,69.23
PA15: length 18.1
  Top Layer w0.178: P2.8 12.72,67.83 16.84,71.96 25.23,71.96 27.7,69.49 27.7,69.48
PB0: length 13.7
  Top Layer w0.178: P3.7 46.52,67.31 33.82,67.31 33.23,67.9
PB1: length 17.3
  Top Layer w0.178: 32.98,67.65 33.64,67 45.18,67 45.95,66.22 47.97,66.22 P3.8
PB2: length 14.9
  Top Layer w0.178: P3.9 44.84,66.69 33.45,66.69 32.74,67.41
PB3: length 18.5
  Top Layer w0.178: 32.49,67.16 33.26,66.39 43.31,66.39 45.91,63.79 48.08,63.79 P3.10
PB4: length 16.3
  Top Layer w0.178: 32.24,66.91 33.41,65.74 43.25,65.74 P3.11
PB5: length 20.1
  Top Layer w0.178: 33.45,65.24 33.41,65.24 32.51,66.14 32.51,66.15 32.2,66.47 32.19,66.47 31.99,66.66
  Top Layer w0.203: 33.45,65.24 41.86,65.24 46.15,60.96 47.79,60.96 P3.12
PB6: length 17.6
  Top Layer w0.178: 31.75,66.42 33.59,64.57 41.88,64.57 P3.13
PB7: length 21.3
  Top Layer w0.178: 31.5,66.17 33.43,64.24 40.56,64.24 46.19,58.62 47.99,58.62 P3.14
PB10: length 75.9
  Top Layer w0.178: USB1.7 37.23,7.32 37.23,6.42 37.01,6.2 36.46,6.2 36.21,6.45 USB1.5 ; 31.25,65.92 36.32,60.85 v2(36.32,60.11) 36.32,43.98 v1(37.5,42.8)
  Top Layer w0.254: v1(37.36,10.46) 37.21,10.31 USB1.7
  Bottom Layer w0.178: v1(37.36,10.46) 37.36,42.13 37.26,42.24 37.26,42.56 v1(37.5,42.8) ; P3.15 46.46,57.46 44.56,57.46 42.3,59.72 36.7,59.72 v2(36.32,60.11)
PB11: length 82.9
  Top Layer w0.178: 35.45,60.16 35.45,60.21 35.72,60.48 35.72,60.96 31,65.67 ; 35.45,60.16 v2(35.45,60.11) ; 35.45,60.16 35.72,59.89 35.72,43.92 36.82,42.8 v1(36.82,41.91) ; USB1.8 37.71,9.49 38.07,9.85 38.07,11.38 37.77,11.68 v1(36.74,11.68) 36.71,11.65 USB1.6
  Bottom Layer w0.178: P3.16 49.18,57.24 48.04,56.1 44.71,56.1 41.42,59.39 35.67,59.39 35.45,59.61 v2(35.45,60.11) 35.45,60.13 ; v1(36.74,11.68) 36.74,41.83 v1(36.82,41.91)
PB12: length 22.1
  Top Layer w0.178: 30.76,65.43 32.9,63.28 32.93,63.28 32.93,61.74 33.17,61.5 v2(33.17,61.37)
  Bottom Layer w0.178: P3.17 45.15,54.73 40.94,58.94 34.3,58.94 33.17,60.08 v2(33.17,61.37)
PB13: length 26
  Top Layer w0.178: 30.51,65.18 32.6,63.09 32.6,61.75 32.44,61.59 32.44,61.5 v2(32.3,61.37)
  Bottom Layer w0.178: v2(32.3,61.37) 32.3,60.47 34.17,58.61 40.52,58.61 45.51,53.62 48.22,53.62 49.18,54.58 P3.18
PB14: length 24.1
  Top Layer w0.178: 30.26,64.93 31.59,63.61 31.59,59.45 v2(32.83,58.21)
  Bottom Layer w0.178: v2(32.83,58.21) 33.99,57.05 40.41,57.05 45.26,52.19 P3.19
PB15: length 28
  Top Layer w0.178: 30.01,64.68 31.26,63.44 31.26,58.89 v2(31.76,58.38)
  Bottom Layer w0.178: P3.20 48.03,51.03 45.28,51.03 39.73,56.58 33.56,56.58 v2(31.76,58.38)
PB18: length 18.4
  Top Layer w0.178: P3.1 45.51,75.05 44.59,74.13 44.59,72.07 43.38,70.86 32.37,70.86 31.51,70
PB19: length 20.4
  Top Layer w0.178: 31.76,69.76 32.56,70.56 43.51,70.56 43.56,70.61 43.77,70.61 45.16,71.99 45.16,73.3 45.88,74.03 48.16,74.03 P3.2
PB20: length 15.9
  Top Layer w0.178: 32,69.51 32,69.51 32.75,70.25 43.85,70.25 45.36,71.76 45.77,71.76 46.52,72.51 P3.3
PB21: length 18.3
  Top Layer w0.178: P3.4 49.11,72.51 47.93,71.33 45.36,71.33 43.97,69.95 32.94,69.95 32.25,69.27 32.25,69.26
PB23: length 80.4
  Top Layer w0.178: 53.21,10.67 53.48,10.94 53.48,36.68 53.47,36.7 ; 32.75,68.77 33,69.02 42.18,69.02 42.23,69.07 45.3,69.07 45.74,68.63 47.85,68.63 P3.6 52.35,69.97 53.47,68.85 53.47,36.71 53.46,36.7
  Top Layer w0.254: 53.47,36.7 53.46,36.7
STAT: length 11.6
  Top Layer w0.508: LED1.1 31.84,30.73 23.37,30.73 22.69,31.41 U4.8
V_SYS: length 11.3
  Top Layer w0.178: 14.36,8.5 13.08,8.5
  Top Layer w0.381: v1(8.13,7.24) 9.55,7.24 10.82,8.5 U3.2
  Bottom Layer w0.381: SW1.2 8.13,2.61 v1(8.13,7.24)
VBS: length 18.6
  Top Layer w0.508: C17.2 31.75,37.41 31.58,37.24 ; D4.2 40.28,37.24 34.24,37.24 ; C16.2 34.42,37.41 34.24,37.24 ; 34.24,37.24 31.58,37.24 ; 37.21,37.46 37.34,37.59 C15.2 ; U4.4 31.58,37.24
VDCID: length 27
  Top Layer w0.178: 26.96,67.43 25.66,66.13 24.77,66.13 ; 28.73,72.75 28.76,72.75 29.22,72.29 29.22,71.95 29.68,71.49
  Top Layer w0.381: C28.2 20.6,65.82 20.6,64.66
  Top Layer w0.508: L4.2 19.49,63.55 20.56,64.62 21.72,64.62 22.37,65.27 24.43,65.27 24.74,65.59 24.74,66.13 ; v2(24.8,66.82) 24.77,66.79 24.77,66.13 ; v2(29,74.54) 29.07,74.47 29.07,73.1 28.73,72.75
  Bottom Layer w0.508: v2(24.8,66.82) 24.82,66.84 26.16,66.84 27.05,67.72 27.05,72.59 v2(29,74.54)
VSW: length 14.2
  Top Layer w0.178: U6.2 24.62,64.58 23.21,64.58 22.66,64.03 22.66,63.98
  Top Layer w0.508: L4.1 21.16,60.45 21.16,62.48 22.66,63.98
X32MI: length 9.5
  Top Layer w0.178: 31.01,70.5 31.04,70.5 32.04,71.5 33.61,71.5 34.11,72 34.11,73.82 34.55,74.25 X1.1
X32MO: length 10.5
  Top Layer w0.178: 31.26,70.25 32.2,71.19 35.1,71.19 35.28,71.37 35.28,72.24 36.2,73.15 38.48,73.15 X1.3
$1N164: length 2.8
  Top Layer w0.381: LED4.1 23.83,14.43 R17.2
$1N5275: length 4.4
  Top Layer w0.178: U3.8 14.1,9.01 14.1,10.67 14.35,10.92 16.01,10.92
  Top Layer w0.508: 16.13,10.92 16.65,10.92 R8.1
$1N7704: length 2.7
  Top Layer w0.508: LED1.2 36.23,30.86 R9.2
$1N7911: length 8.7
  Top Layer w0.508: R10.1 18.2,30.34 NTH1.1 20.72,32.81 21.08,33.17 21.08,34.41 21.37,34.7 U4.7
$1N8019: length 4.5
  Top Layer w0.508: R11.1 U4.6
$1N8947: length 3.5
  Top Layer w0.508: 16.07,24.38 15.78,24.67 U5.1
$1N8982: length 10.8
  Top Layer w0.508: D6.2 13.74,19.87 14.1,20.23 14.1,21.59 13.59,22.1 11.55,22.1 10.53,23.11 10.53,25.94 10.4,26.07
$1N12468: length 1.9
  Top Layer w0.508: LED3.2 21.9,47.8 21.88,47.78
$1N12470: length 1.9
  Top Layer w0.508: 21.88,45.72 23.66,45.72 LED2.2
$1N14257: length 5.4
  Top Layer w0.381: 35.71,7.35 35.71,10.35 34.67,11.39 R19.2

## Copper pours and planes (outline as drawn; the poured copper is in the pictures)
GND on Top Layer: 31.42,77.59 50.67,77.59 50.67,76.58 31.42,76.58
GND on Top Layer: -9.14,77.59 63.5,77.59 63.5,-4.57 -9.14,-4.57
GND on Top Layer: 29.68,70.54 27.27,68.12 27.27,67.94 29.68,65.53 29.85,65.53 32.39,68.07 29.92,70.54
GND on Top Layer: 31.83,78.38 32.89,78.38 32.89,77.31 31.83,77.31
GND on Top Layer: 26.42,71.12 32.51,71.12 32.51,65.4 26.42,65.4
GND on Bottom Layer: -15.11,77.59 77.22,77.59 77.22,-16 -15.11,-16

Small or netless copper shapes (teardrops, artwork), in the pictures only: 469 on Top Layer, 153 on Bottom Layer

## Text on the board
Top Silkscreen Layer: BAT- | BAT+ | FS | OFF | PA13 | PA12 | PA10 | PB17 | PB16 | PA4 | PA6 | PA3 | PA8 | PB9 | PB8 | GND | PA1 | ON | PA15 | 3V3 | PA5 | PA0 | PA2 | PA14 | PA11 | PA9 | PA7 | NFC_CTR | LED0 | LED1 | VCC | PB20 | PB22 | PB10 | PB12 | PB14 | PB18 | PB0 | PB2 | PB4 | PB6 | 5V | PB23 | PB19 | PB21 | PB1 | PB3 | PB5 | PB7 | PB11 | PB13 | PB15
